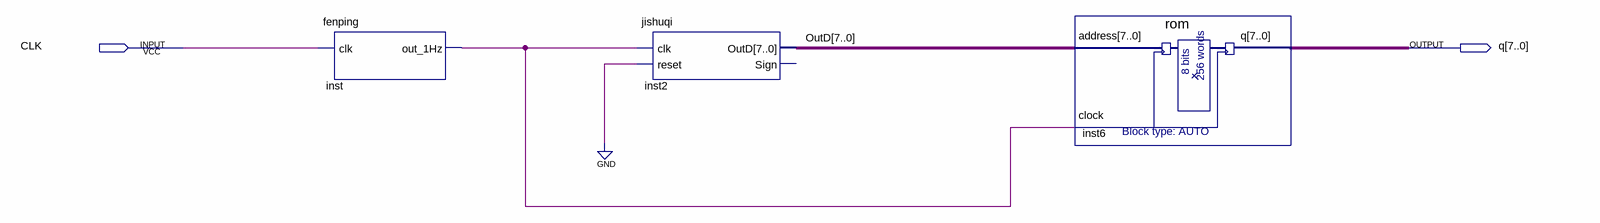
[diagram p0: schematic sheet]
// Quartus schematic test5.bdf as structural Verilog: 3 symbols, 2 pins
module test5 (
  input  CLK,
  output [7:0] q
);

  wire inst_out_1hz;
  wire [7:0] OutD;

  fenping inst (.clk(CLK), .out_1Hz(inst_out_1hz));
  jishuqi inst2 (.clk(inst_out_1hz), .reset(1'b0), .OutD(OutD));  // open: Sign
  rom inst6 (.address(OutD), .clock(inst_out_1hz), .q(q));
endmodule
